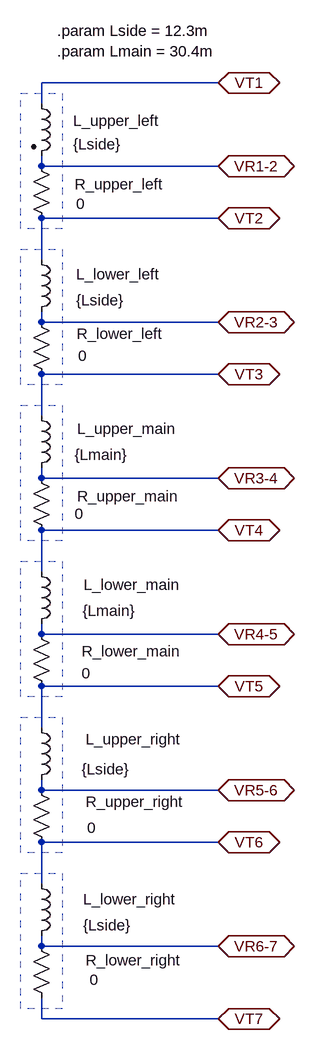
[diagram p0: schematic full_magnet_model_6.asc]
full_magnet_model_6.asc, the LTspice schematic file:
Version 4
SHEET 1 880 872
WIRE 272 -640 0 -640
WIRE 0 -608 0 -640
WIRE 0 -512 0 -528
WIRE 272 -512 0 -512
WIRE 272 -432 0 -432
WIRE 0 -368 0 -432
WIRE 0 -272 0 -288
WIRE 272 -272 0 -272
WIRE 272 -192 0 -192
WIRE 0 -128 0 -192
WIRE 0 -32 0 -48
WIRE 272 -32 0 -32
WIRE 272 48 0 48
WIRE 0 112 0 48
WIRE 0 208 0 192
WIRE 272 208 0 208
WIRE 272 288 0 288
WIRE 0 352 0 288
WIRE 0 448 0 432
WIRE 272 448 0 448
WIRE 272 528 0 528
WIRE 0 592 0 528
WIRE 0 688 0 672
WIRE 272 688 0 688
WIRE 0 800 0 768
WIRE 272 800 0 800
FLAG 272 -640 VT1
IOPIN 272 -640 BiDir
FLAG 272 -272 VR2-3
IOPIN 272 -272 BiDir
FLAG 272 -192 VT3
IOPIN 272 -192 BiDir
FLAG 272 -32 VR3-4
IOPIN 272 -32 BiDir
FLAG 272 48 VT4
IOPIN 272 48 BiDir
FLAG 272 208 VR4-5
IOPIN 272 208 BiDir
FLAG 272 288 VT5
IOPIN 272 288 BiDir
FLAG 272 448 VR5-6
IOPIN 272 448 BiDir
FLAG 272 528 VT6
IOPIN 272 528 BiDir
FLAG 272 688 VR6-7
IOPIN 272 688 BiDir
FLAG 272 800 VT7
IOPIN 272 800 BiDir
FLAG 272 -432 VT2
IOPIN 272 -432 BiDir
FLAG 272 -512 VR1-2
IOPIN 272 -512 BiDir
SYMBOL ind -16 -144 R0
WINDOW 0 71 36 Left 2
WINDOW 3 67 76 Left 2
SYMATTR InstName L_upper_main
SYMATTR Value {Lmain}
SYMATTR SpiceLine Rser=0 Rpar=0
SYMBOL ind -16 96 R0
WINDOW 0 81 36 Left 2
WINDOW 3 79 76 Left 2
SYMATTR InstName L_lower_main
SYMATTR Value {Lmain}
SYMATTR SpiceLine Rser=0 Rpar=0
SYMBOL res -16 -48 R0
WINDOW 0 71 44 Left 2
WINDOW 3 67 71 Left 2
SYMATTR InstName R_upper_main
SYMATTR Value 0
SYMBOL ind2 -16 -624 R0
WINDOW 0 65 42 Left 2
WINDOW 3 65 78 Left 2
SYMATTR InstName L_upper_left
SYMATTR Value {Lside}
SYMATTR Type ind
SYMATTR SpiceLine Rser=0 Rpar=0
SYMBOL ind -16 -384 R0
WINDOW 0 69 38 Left 2
WINDOW 3 69 78 Left 2
SYMATTR InstName L_lower_left
SYMATTR Value {Lside}
SYMATTR SpiceLine Rser=0 Rpar=0
SYMBOL ind -16 336 R0
WINDOW 0 84 34 Left 2
WINDOW 3 78 80 Left 2
SYMATTR InstName L_upper_right
SYMATTR Value {Lside}
SYMATTR SpiceLine Rser=0 Rpar=0
SYMBOL ind -16 576 R0
WINDOW 0 80 40 Left 2
WINDOW 3 80 80 Left 2
SYMATTR InstName L_lower_right
SYMATTR Value {Lside}
SYMATTR SpiceLine Rser=0 Rpar=0
SYMBOL res -16 -288 R0
WINDOW 0 70 34 Left 2
WINDOW 3 72 68 Left 2
SYMATTR InstName R_lower_left
SYMATTR Value 0
SYMBOL res -16 -528 R0
WINDOW 0 67 44 Left 2
WINDOW 3 69 74 Left 2
SYMATTR InstName R_upper_left
SYMATTR Value 0
SYMBOL res -16 192 R0
WINDOW 0 78 42 Left 2
WINDOW 3 78 76 Left 2
SYMATTR InstName R_lower_main
SYMATTR Value 0
SYMBOL res -16 432 R0
WINDOW 0 84 34 Left 2
WINDOW 3 86 74 Left 2
SYMATTR InstName R_upper_right
SYMATTR Value 0
SYMBOL res -16 672 R0
WINDOW 0 84 38 Left 2
WINDOW 3 90 68 Left 2
SYMATTR InstName R_lower_right
SYMATTR Value 0
TEXT 24 -720 Left 2 !.param Lside = 12.3m\n.param Lmain = 30.4m
RECTANGLE Normal 32 -416 -32 -624 2
RECTANGLE Normal 32 -176 -32 -384 2
RECTANGLE Normal 32 64 -32 -144 2
RECTANGLE Normal 32 304 -32 96 2
RECTANGLE Normal 32 544 -32 336 2
RECTANGLE Normal 32 784 -32 576 2

The netlist it stands for:
* full_magnet_model_6.asc
L_upper_main VT3 VR3-4 {Lmain} Rser=0 Rpar=0
L_lower_main VT4 VR4-5 {Lmain} Rser=0 Rpar=0
R_upper_main VR3-4 VT4 0
L_upper_left VT1 VR1-2 {Lside} Rser=0 Rpar=0
L_lower_left VT2 VR2-3 {Lside} Rser=0 Rpar=0
L_upper_right VT5 VR5-6 {Lside} Rser=0 Rpar=0
L_lower_right VT6 VR6-7 {Lside} Rser=0 Rpar=0
R_lower_left VR2-3 VT3 0
R_upper_left VR1-2 VT2 0
R_lower_main VR4-5 VT5 0
R_upper_right VR5-6 VT6 0
R_lower_right VR6-7 VT7 0
.param Lside = 12.3m
.param Lmain = 30.4m
.backanno
.end